# Altium schematic sheet 3_wiring drawing.SchDoc: Current sensors and IFB
size A2; ApprovedBy: Approved By; CheckedBy: Among; DrawnBy: Sky Ma; Address1: 1; Address2: 2; Address3: 3; Address4: 4; DocumentNumber: 04-TE-42-4015-0PA-A; Revision: B; SheetNumber: 4; SheetTotal: 6; SheetSize: A2; CheckedByDate: 2022-01-11; DrawByDate: 2022-11-19; SiteName: EMS TD Huangpu; ProjectName: 19205_BMW CCU DDR PCBA FT fixture wiring
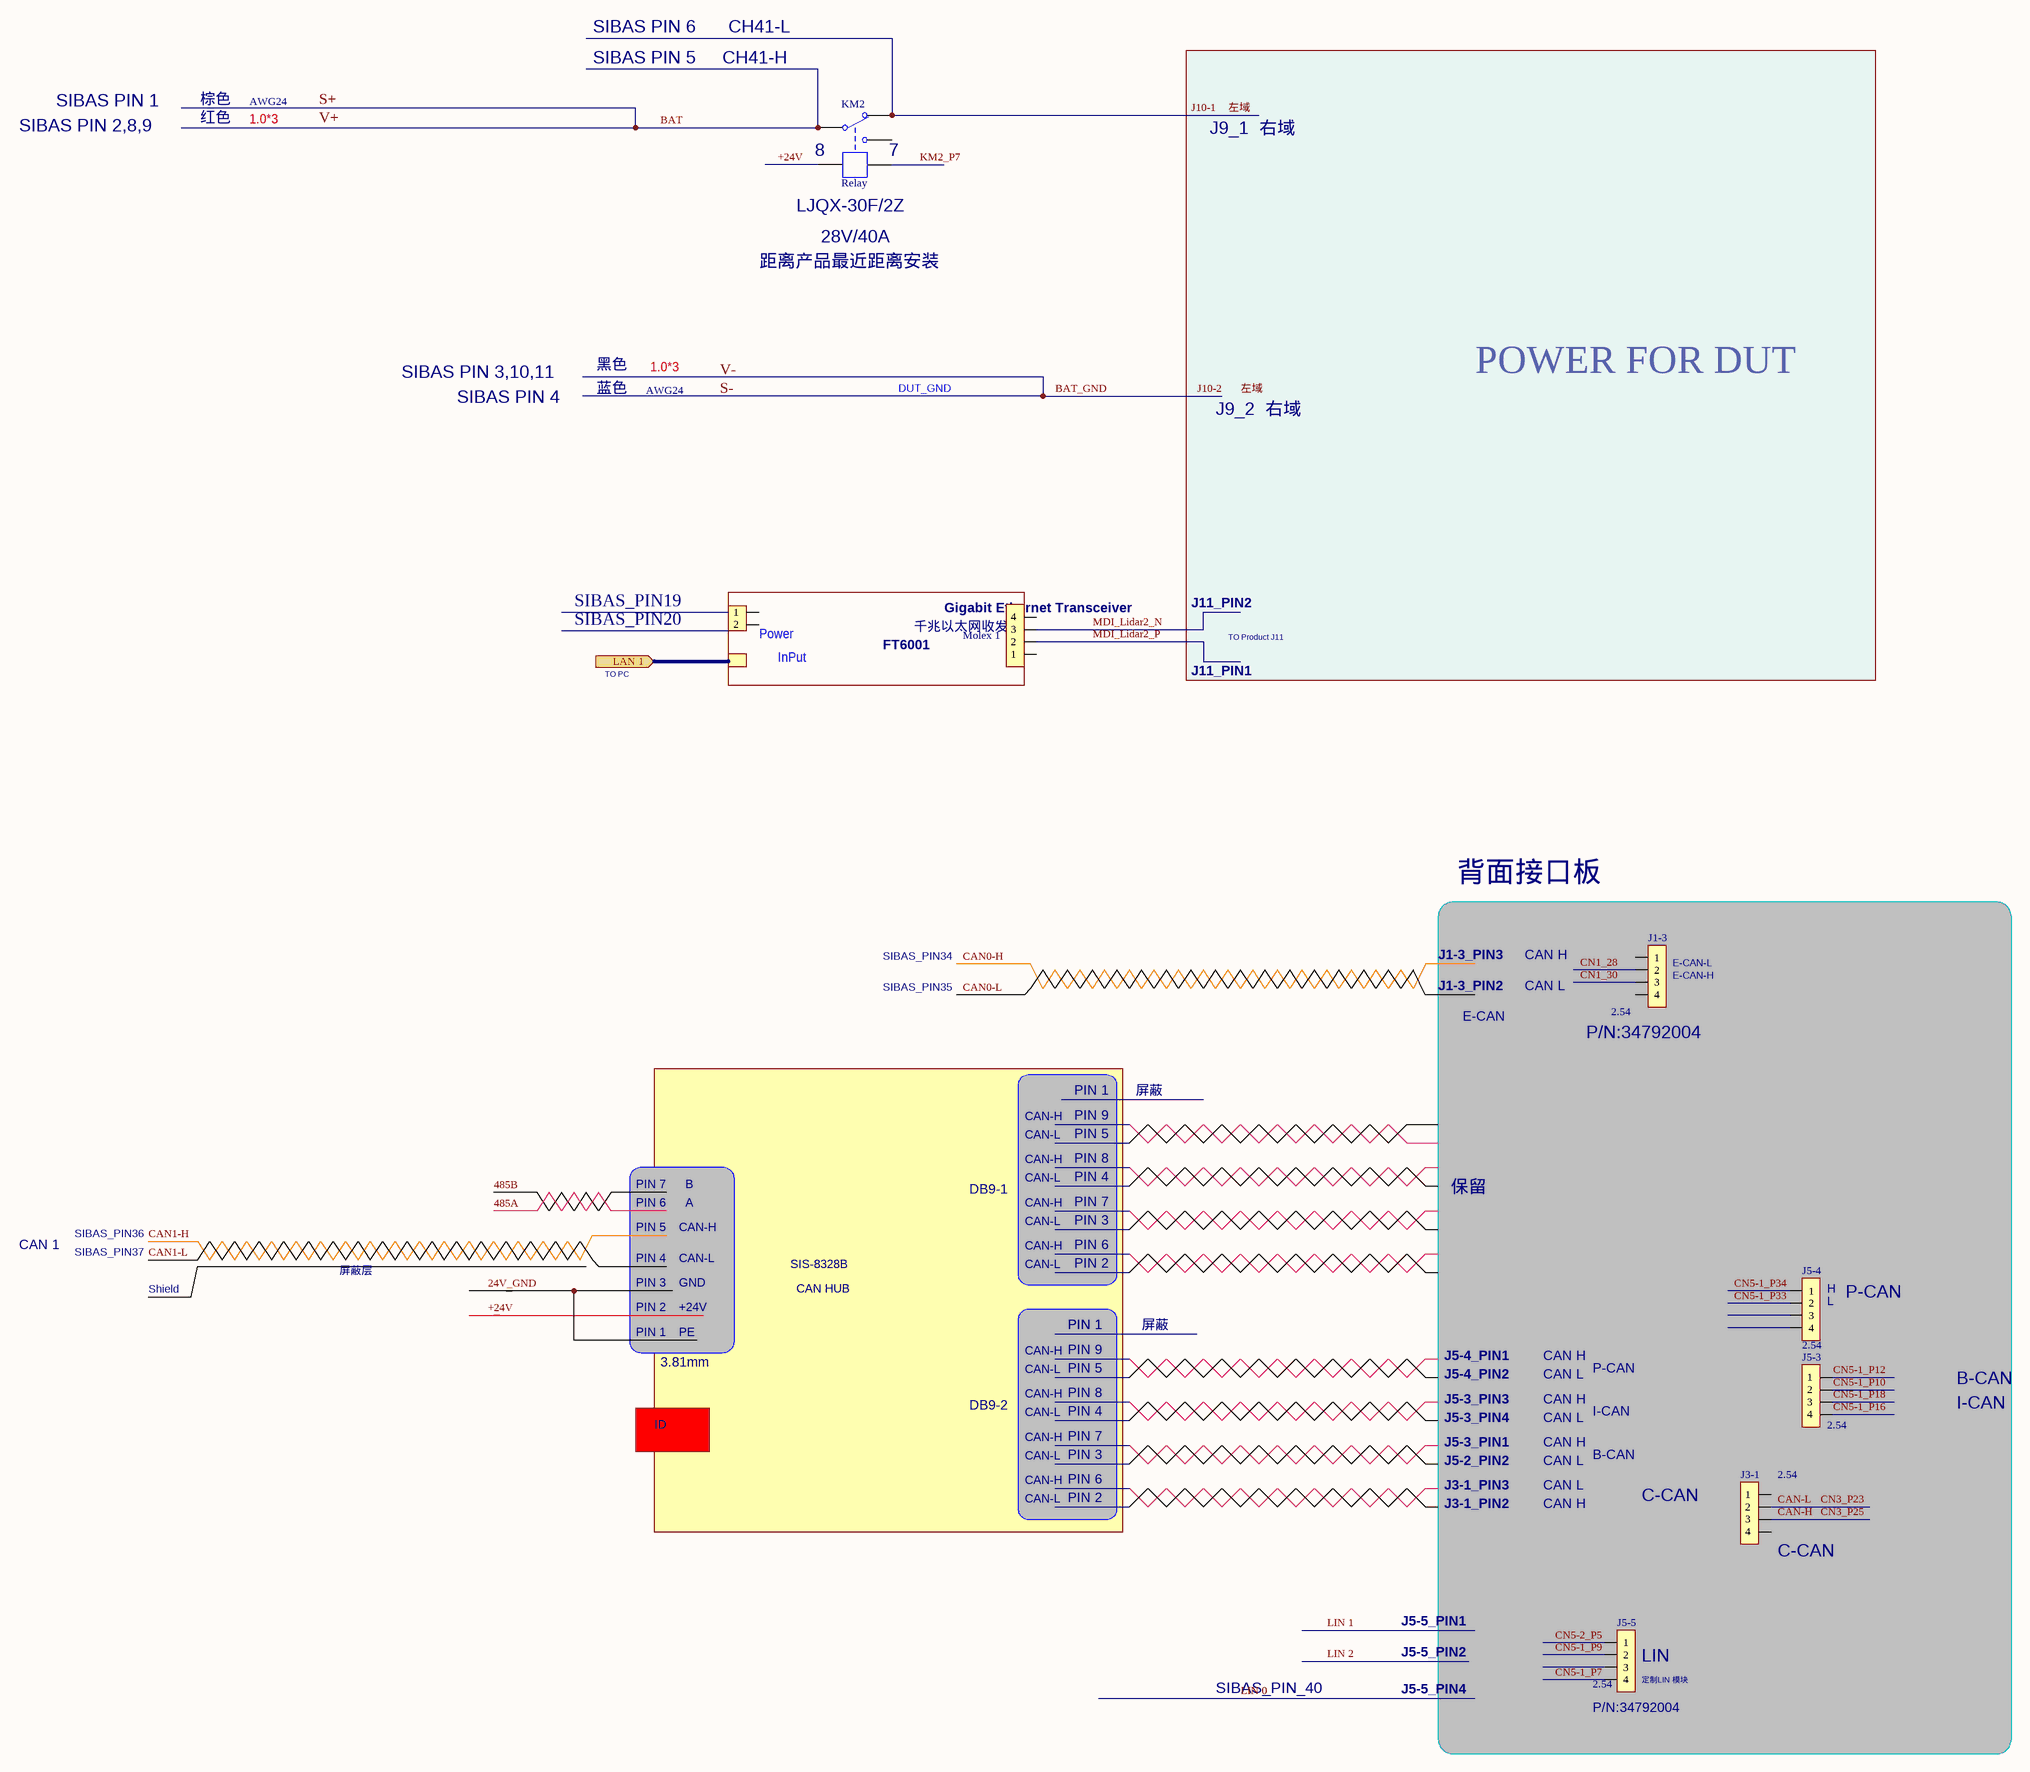
[diagram p0: 3_wiring drawing.SchDoc]

## Parts
1  2.54 connector  [2.54mm-2]  (value not drawn)
J1-3  2.54  [2.54mm-4]
J3-1  2.54  [2.54mm-4]
J5-3  2.54  [2.54mm-4]
J5-4  2.54  [2.54mm-4]
J5-5  2.54  [2.54mm-4]
KM2  Relay
Molex_1  2.54 connector  [2.54mm-4]  (value not drawn)

## Blocks framed on the sheet
背面接口板: J1-3 J3-1 J5-3-J5-5

## Ports
LAN 1 (in)

## Nets
+24V: KM2.4
BAT: KM2.1
CAN-H: J3-1.3  [also labelled CN3_P25]
CAN-L: J3-1.2  [also labelled CN3_P23]
CN1_28: J1-3.2
CN1_30: J1-3.3
CN5-1_P7: J5-5.4
CN5-1_P9: J5-5.2
CN5-1_P10: J5-3.2
CN5-1_P12: J5-3.1
CN5-1_P16: J5-3.4
CN5-1_P18: J5-3.3
CN5-1_P33: J5-4.2
CN5-1_P34: J5-4.1
CN5-2_P5: J5-5.1
J10-1: KM2.2  [also labelled 左域]
KM2_P7: KM2.5
MDI_Lidar2_N: Molex_1.3
MDI_Lidar2_P: Molex_1.2

Not connected (* = marked no-connect by the designer): 1 1 2; J1-3 1 4; J3-1 1 4; J5-4 3 4; J5-5 3; KM2 3; Molex_1 1 4

## Notes on the sheet
- SIBAS PIN 5
- SIBAS PIN 6
- CH41-H
- CH41-L
- SIBAS PIN 2,8,9
- SIBAS PIN 1
- 棕色
- 红色
- 1.0*3
- AWG24
- S+
- V+
- J9_1
- 右域
- (near KM2) 8
- (near KM2) 7
- 距离产品最近距离安装
- (near KM2) LJQX-30F/2Z
- 28V/40A
- SIBAS PIN 3,10,11
- 黑色
- 蓝色
- V-
- S-
- POWER FOR DUT
- SIBAS PIN 4
- J9_2
- SIBAS_PIN19
- SIBAS_PIN20
- (near 1) Power
- 千兆以太网收发器
- (near 1) Gigabit Ethernet Transceiver
- J11_PIN2
- TO Product J11
- TO PC
- (near 1) InPut
- FT6001
- J11_PIN1
- SIBAS_PIN34
- SIBAS_PIN35
- J1-3_PIN2
- J1-3_PIN3
- CAN H
- CAN L
- (near J1-3) E-CAN-H
- (near J1-3) E-CAN-L
- E-CAN
- (near J1-3) P/N:34792004
- CAN-H
- CAN-L
- PIN 1
- PIN 5
- PIN 9
- 屏蔽
- PIN 7
- B
- DB9-1
- PIN 4
- PIN 8
- 保留
- CAN 1
- SIBAS_PIN36
- SIBAS_PIN37
- PIN 6
- A
- PIN 3
- Shield
- 屏蔽层
- PIN 2
- 3.81mm
- GND
- +24V
- SIS-8328B
- CAN HUB
- (near J5-4) H
- (near J5-4) L
- (near J5-4) P-CAN
- PE
- J5-4_PIN2
- J5-4_PIN1
- P-CAN
- B-CAN
- ID
- DB9-2
- J5-3_PIN4
- J5-3_PIN3
- I-CAN
- J5-2_PIN2
- J5-3_PIN1
- J3-1_PIN2
- J3-1_PIN3
- C-CAN
- (near J3-1) C-CAN
- J5-5_PIN1
- J5-5_PIN2
- (near J5-5) LIN
- (near J5-5) 定制LIN 模块
- SIBAS_PIN_40
- J5-5_PIN4
- (near J5-5) P/N:34792004
- Labels drawn without touching a wire or pin: 24V_GND, 485A, 485B, +24V, CAN0-H, CAN0-L, CAN1-H, CAN1-L, 左域
- Document Number:
- Rev:
- Project Name:
- Drawn By:
- Date:
- Titile:
- Checked By:
- Sheet:
- Of

## Library data of the parts
1 = CON2-2.54
J1-3 J3-1 J5-3-J5-5 Molex_1 = CON4-2.54
KM2 = RELAY_SPDT